# EAGLE design ParticleWings (EAGLE 7.3.0)
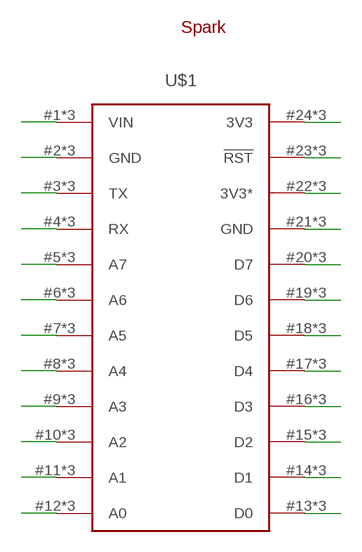
[diagram p0: schematic, sheet 1]

## Parts
U$1  SPARK_CORE  [SPARK_CORE_STACKABLE]
U$2  SPARK_LOGO_WITH_PLANE  [SPARK_LOGO_PLUS_PLANE]

## Nets
N$1: U$1.1(VIN) U$1.#1(VIN) U$1.@1(VIN)
N$2: U$1.2(GND) U$1.#2(GND) U$1.@2(GND)
N$3: U$1.3(TX) U$1.#3(TX) U$1.@3(TX)
N$4: U$1.4(RX) U$1.#4(RX) U$1.@4(RX)
N$5: U$1.5(A7) U$1.#5(A7) U$1.@5(A7)
N$6: U$1.6(A6) U$1.#6(A6) U$1.@6(A6)
N$7: U$1.7(A5) U$1.#7(A5) U$1.@7(A5)
N$8: U$1.8(A4) U$1.#8(A4) U$1.@8(A4)
N$9: U$1.9(A3) U$1.#9(A3) U$1.@9(A3)
N$10: U$1.10(A2) U$1.#10(A2) U$1.@10(A2)
N$11: U$1.11(A1) U$1.#11(A1) U$1.@11(A1)
N$12: U$1.12(A0) U$1.#12(A0) U$1.@12(A0)
N$13: U$1.13(D0) U$1.#13(D0) U$1.@13(D0)
N$14: U$1.14(D1) U$1.#14(D1) U$1.@14(D1)
N$15: U$1.15(D2) U$1.#15(D2) U$1.@15(D2)
N$16: U$1.16(D3) U$1.#16(D3) U$1.@16(D3)
N$17: U$1.17(D4) U$1.#17(D4) U$1.@17(D4)
N$18: U$1.18(D5) U$1.#18(D5) U$1.@18(D5)
N$19: U$1.19(D6) U$1.#19(D6) U$1.@19(D6)
N$20: U$1.20(D7) U$1.#20(D7) U$1.@20(D7)
N$21: U$1.21(GND) U$1.#21(GND) U$1.@21(GND)
N$22: U$1.22(3V3*) U$1.#22(3V3*) U$1.@22(3V3*)
N$23: U$1.23(!RST) U$1.#23(!RST) U$1.@23(!RST)
N$24: U$1.24(3V3) U$1.#24(3V3) U$1.@24(3V3)

## Library data of the parts
U$1 = Spark:SPARK_CORE
U$2 = Spark:SPARK_LOGO_WITH_PLANE

## Board
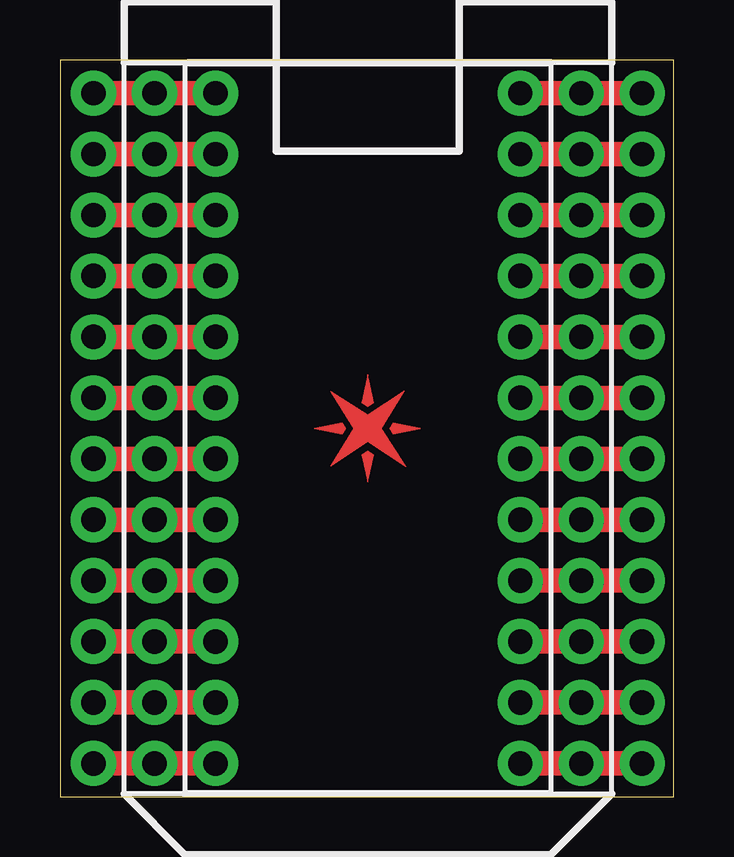
[diagram p1: board, top side]

Size 25.58 x 30.72 mm. Coordinates in mm from the lower left corner, seen from the top.
Outline: 0,0 25.58,0 25.58,30.72 0,30.72 0,0
Copper layers (1*16): Top 0.035mm / dielectric 1.5mm / Bottom 0.035mm
Design rules "default": minimum track width 10mil, minimum drill 24mil, track to track 8mil, track to pad 8mil, pad to pad 8mil, via to via 8mil, smd to smd 8mil, copper to edge 40mil, drill to drill 8mil, minimum pad ring 10mil, minimum via ring 8mil, stop-mask expansion 4mil, vias tented up to drill 0mil, thermal gap 10mil

### Footprints (pad centres in the part's own frame; a part is rotated, then mirrored left to right if it is on the bottom)
SPARK_CORE_STACKABLE = drill 1.016 pad 1.88: 1 -8.89,13.97; 2 -8.89,11.43; 3 -8.89,8.89; 4 -8.89,6.35; 5 -8.89,3.81; 6 -8.89,1.27; 7 -8.89,-1.27; 8 -8.89,-3.81; 9 -8.89,-6.35; 10 -8.89,-8.89; 11 -8.89,-11.43; 12 -8.89,-13.97; 13 8.89,-13.97; 14 8.89,-11.43; 15 8.89,-8.89; 16 8.89,-6.35; 17 8.89,-3.81; 18 8.89,-1.27; 19 8.89,1.27; 20 8.89,3.81; 21 8.89,6.35; 22 8.89,8.89; 23 8.89,11.43; 24 8.89,13.97; #1 -6.35,13.97; #2 -6.35,11.43; #3 -6.35,8.89; #4 -6.35,6.35; #5 -6.35,3.81; #6 -6.35,1.27; #7 -6.35,-1.27; #8 -6.35,-3.81; #9 -6.35,-6.35; #10 -6.35,-8.89; #11 -6.35,-11.43; #12 -6.35,-13.97; #13 11.43,-13.97; #14 11.43,-11.43; #15 11.43,-8.89; #16 11.43,-6.35; #17 11.43,-3.81; #18 11.43,-1.27; #19 11.43,1.27; #20 11.43,3.81; #21 11.43,6.35; #22 11.43,8.89; #23 11.43,11.43; #24 11.43,13.97; @1 -11.43,13.97; @2 -11.43,11.43; @3 -11.43,8.89; @4 -11.43,6.35; @5 -11.43,3.81; @6 -11.43,1.27; @7 -11.43,-1.27; @8 -11.43,-3.81; @9 -11.43,-6.35; @10 -11.43,-8.89; @11 -11.43,-11.43; @12 -11.43,-13.97; @13 6.35,-13.97; @14 6.35,-11.43; @15 6.35,-8.89; @16 6.35,-6.35; @17 6.35,-3.81; @18 6.35,-1.27; @19 6.35,1.27; @20 6.35,3.81; @21 6.35,6.35; @22 6.35,8.89; @23 6.35,11.43; @24 6.35,13.97

### Placement (x,y rotation side)
U$1  12.83,15.37 0 top
U$2  12.83,15.37 0 top

### Tracks (layer width: path | path; a pad name or v marks a point on that pad's centre or on a via)
N$1
  Top 1.016: U$1.@1 U$1.1 U$1.#1
N$2
  Top 1.016: U$1.#2 U$1.2 U$1.@2
N$3
  Top 1.016: U$1.@3 U$1.3 U$1.#3
N$4
  Top 1.016: U$1.#4 U$1.4 U$1.@4
N$5
  Top 1.016: U$1.@5 U$1.5 U$1.#5
N$6
  Top 1.016: U$1.#6 U$1.6 U$1.@6
N$7
  Top 1.016: U$1.@7 U$1.7 U$1.#7
N$8
  Top 1.016: U$1.@8 U$1.8 U$1.#8
N$9
  Top 1.016: U$1.#9 U$1.9 U$1.@9
N$10
  Top 1.016: U$1.@10 U$1.10 U$1.#10
N$11
  Top 1.016: U$1.#11 U$1.11 U$1.@11
N$12
  Top 1.016: U$1.@12 U$1.12 U$1.#12
N$13
  Top 1.016: U$1.@13 U$1.13 U$1.#13
N$14
  Top 1.016: U$1.#14 U$1.14 U$1.@14
N$15
  Top 1.016: U$1.@15 U$1.15 U$1.#15
N$16
  Top 1.016: U$1.#16 U$1.16 U$1.@16
N$17
  Top 1.016: U$1.@17 U$1.17 U$1.#17
N$18
  Top 1.016: U$1.#18 U$1.18 U$1.@18
N$19
  Top 1.016: U$1.@19 U$1.19 U$1.#19
N$20
  Top 1.016: U$1.#20 U$1.20 U$1.@20
N$21
  Top 1.016: U$1.@21 U$1.21 U$1.#21
N$22
  Top 1.016: U$1.@22 U$1.22 U$1.#22
N$23
  Top 1.016: U$1.#23 U$1.23 U$1.@23
N$24
  Top 1.016: U$1.@24 U$1.24 U$1.#24